# Altium project Bike_Light_PCB_2017.PrjPcb
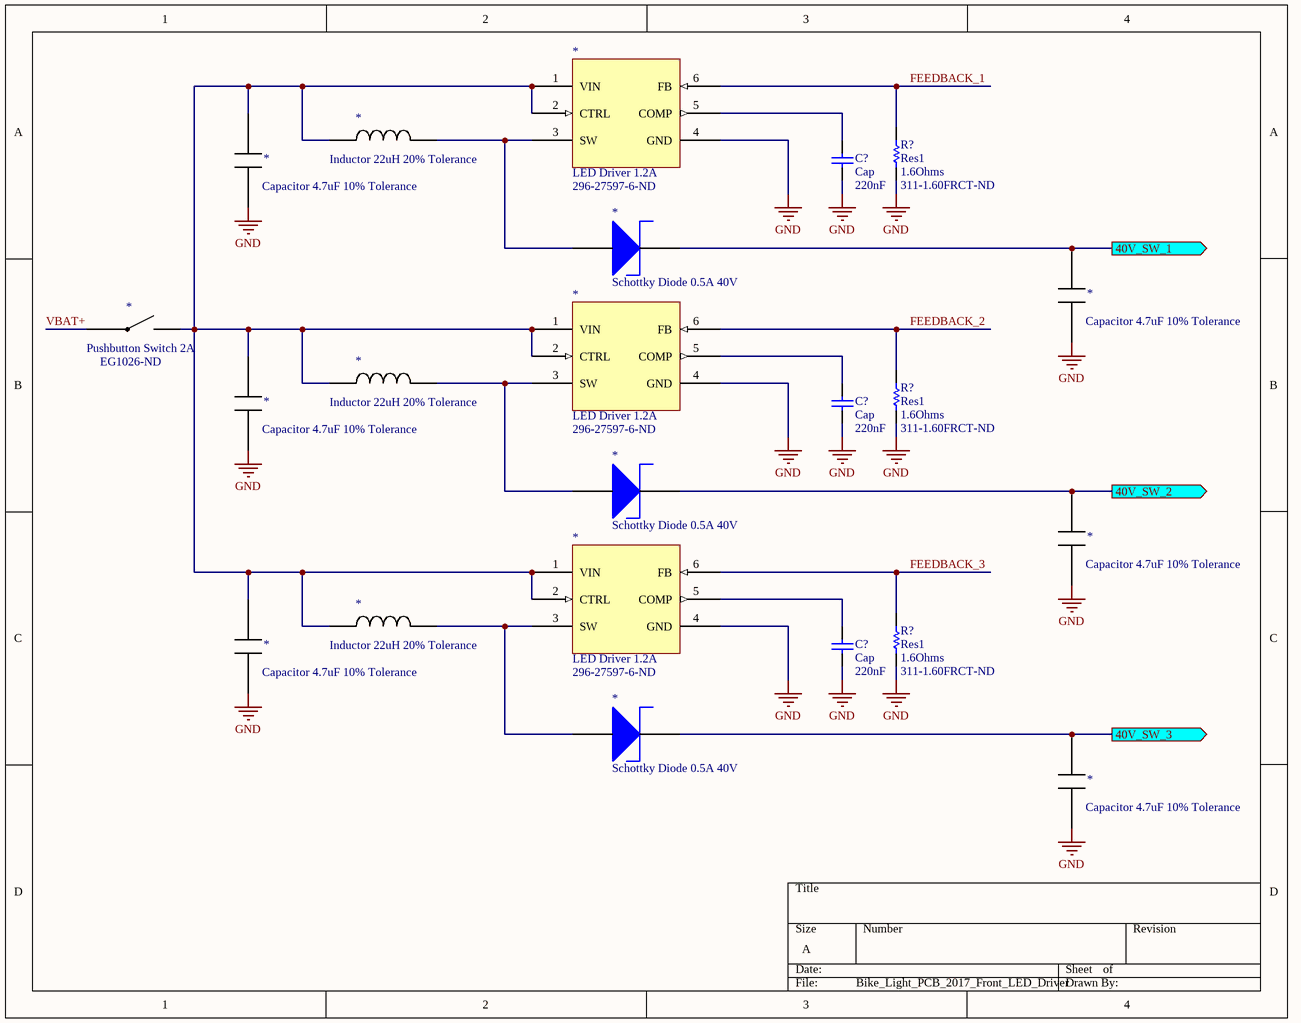
[diagram p0: Bike_Light_PCB_2017_Front_LED_Driver.SchDoc]
3 sheets, 46 parts. Net scope: flat (ports and power ports of the same name join across sheets).
Sheets:
  Bike_Light_PCB_2017_Front_LED_Driver.SchDoc
  Bike_Light_PCB_2017_Front_LED.SchDoc
  Bike_Light_PCB_2017_Power.SchDoc

## Sheet Bike_Light_PCB_2017_Front_LED_Driver.SchDoc
size A

### Parts
(Parts that share a designator on the sheet are numbered #1, #2 ... from top to bottom, then left to right.)
*#1  Inductor 22uH 20% Tolerance
*#2  Capacitor 4.7uF 10% Tolerance
*#3  LED Driver 1.2A  Supplier Part Number 1: 296-27597-6-ND
*#4  Schottky Diode 0.5A 40V
*#5  Capacitor 4.7uF 10% Tolerance
*#6  Pushbutton Switch 2A  Supplier Part Number 1: EG1026-ND
*#7  Inductor 22uH 20% Tolerance
*#8  Capacitor 4.7uF 10% Tolerance
*#9  LED Driver 1.2A  Supplier Part Number 1: 296-27597-6-ND
*#10  Schottky Diode 0.5A 40V
*#11  Capacitor 4.7uF 10% Tolerance
*#12  Inductor 22uH 20% Tolerance
*#13  Capacitor 4.7uF 10% Tolerance
*#14  LED Driver 1.2A  Supplier Part Number 1: 296-27597-6-ND
*#15  Schottky Diode 0.5A 40V
*#16  Capacitor 4.7uF 10% Tolerance
C?#1  Cap  value 220nF  [RAD-0.3]
C?#2  Cap  value 220nF  [RAD-0.3]
C?#3  Cap  value 220nF  [RAD-0.3]
R?#1  Res1  value 1.6Ohms  Supplier Part Number 1: 311-1.60FRCT-ND  [AXIAL-0.3]
R?#2  Res1  value 1.6Ohms  Supplier Part Number 1: 311-1.60FRCT-ND  [AXIAL-0.3]
R?#3  Res1  value 1.6Ohms  Supplier Part Number 1: 311-1.60FRCT-ND  [AXIAL-0.3]

### Ports
40V_SW_1 (out), 40V_SW_2 (out), 40V_SW_3 (out)

### Nets
GND: *#2.0 *#3.4(GND) *#5.0 *#8.0 *#9.4(GND) *#11.0 *#13.0 *#14.4(GND) *#16.0 C?#1.1 C?#2.1 C?#3.1 R?#1.1 R?#2.1 R?#3.1  [project net ENABLE]
FEEDBACK_1: *#3.6(FB) R?#1.2
FEEDBACK_2: *#9.6(FB) R?#2.2
FEEDBACK_3: *#14.6(FB) R?#3.2
VBAT+: *#6.10
Net*#1_28: *#1.28 *#2.1 *#3.1(VIN) *#3.2(CTRL) *#6.11 *#7.28 *#8.1 *#9.1(VIN) *#9.2(CTRL) *#12.28 *#13.1 *#14.1(VIN) *#14.2(CTRL)
Net*#1_29: *#1.29 *#3.3(SW) *#4.2
Net*#3_5: *#3.5(COMP) C?#1.2
Net*#4_3: *#4.3 *#5.1 ; port 40V_SW_1
Net*#7_29: *#7.29 *#9.3(SW) *#10.2
Net*#9_5: *#9.5(COMP) C?#2.2
Net*#10_3: *#10.3 *#11.1 ; port 40V_SW_2
Net*#12_29: *#12.29 *#14.3(SW) *#15.2
Net*#14_5: *#14.5(COMP) C?#3.2
Net*#15_3: *#15.3 *#16.1 ; port 40V_SW_3

### Library data of the parts
C?#1-C?#3 = Cap: Capacitor; Published: 8-Jun-2000; LatestRevisionDate: 17-Jul-2002; LatestRevisionNote: Re-released for DXP Platform.; PackageReference: RAD-0.3; Publisher: Altium Limited; PackageDescription: Radial Cap, Thru-Hole; 2 Leads; 0.3 in Pin Spacing; Supplier 1: Digi-Key; Supplier Part Number 1: 399-14760-1-ND
R?#1-R?#3 = Res1: Resistor; Published: 8-Jun-2000; LatestRevisionDate: 17-Jul-2002; LatestRevisionNote: Re-released for DXP Platform.; PackageReference: AXIAL-0.3; Publisher: Altium Limited; PackageDescription: Axial Device, Thru-Hole; 2 Leads; 0.3 in Pin Spacing; Supplier 1: Digi-Key
*#1 *#7 *#12 = Inductor 22uH 20% Tolerance: Supplier 1: Digi-Key; Supplier Part Number 1: 445-174218-1-ND
*#2 *#5 *#8 *#11 *#13 *#16 = Capacitor 4.7uF 10% Tolerance: Supplier 1: Digi-Key; Supplier Part Number 1: 587-5034-2-ND
*#3 *#9 *#14 = LED Driver 1.2A: Supplier 1: Digi-Key
*#4 *#10 *#15 = Schottky Diode 0.5A 40V: Supplier 1: Digi-Key; Supplier Part Number 1: MBR0540CT-ND
*#6 = Pushbutton Switch 2A: Supplier 1: Digi-Key

## Sheet Bike_Light_PCB_2017_Front_LED.SchDoc
size A
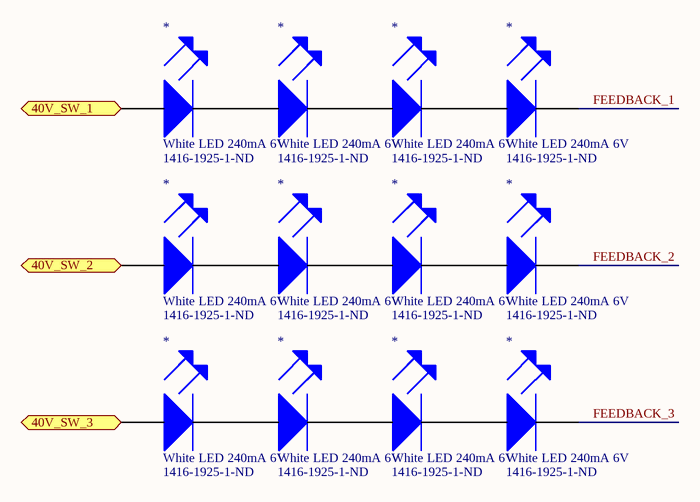
[diagram p1: Bike_Light_PCB_2017_Front_LED.SchDoc]

### Parts
(Parts that share a designator on the sheet are numbered #1, #2 ... from top to bottom, then left to right.)
*#17  White LED 240mA 6V  Supplier Part Number 1: 1416-1925-1-ND
*#18  White LED 240mA 6V  Supplier Part Number 1: 1416-1925-1-ND
*#19  White LED 240mA 6V  Supplier Part Number 1: 1416-1925-1-ND
*#20  White LED 240mA 6V  Supplier Part Number 1: 1416-1925-1-ND
*#21  White LED 240mA 6V  Supplier Part Number 1: 1416-1925-1-ND
*#22  White LED 240mA 6V  Supplier Part Number 1: 1416-1925-1-ND
*#23  White LED 240mA 6V  Supplier Part Number 1: 1416-1925-1-ND
*#24  White LED 240mA 6V  Supplier Part Number 1: 1416-1925-1-ND
*#25  White LED 240mA 6V  Supplier Part Number 1: 1416-1925-1-ND
*#26  White LED 240mA 6V  Supplier Part Number 1: 1416-1925-1-ND
*#27  White LED 240mA 6V  Supplier Part Number 1: 1416-1925-1-ND
*#28  White LED 240mA 6V  Supplier Part Number 1: 1416-1925-1-ND

### Ports
40V_SW_1 (in), 40V_SW_2 (in), 40V_SW_3 (in)

### Nets
FEEDBACK_1: *#20.3
FEEDBACK_2: *#24.3
FEEDBACK_3: *#28.3
Net*#4_3: *#17.2 ; port 40V_SW_1
Net*#10_3: *#21.2 ; port 40V_SW_2
Net*#15_3: *#25.2 ; port 40V_SW_3
Net*#17_3: *#17.3 *#18.2
Net*#18_3: *#18.3 *#19.2
Net*#19_3: *#19.3 *#20.2
Net*#21_3: *#21.3 *#22.2
Net*#22_3: *#22.3 *#23.2
Net*#23_3: *#23.3 *#24.2
Net*#25_3: *#25.3 *#26.2
Net*#26_3: *#26.3 *#27.2
Net*#27_3: *#27.3 *#28.2

### Library data of the parts
*#17-*#28 = White LED 240mA 6V: Supplier 1: Digi-Key

## Sheet Bike_Light_PCB_2017_Power.SchDoc
size A4
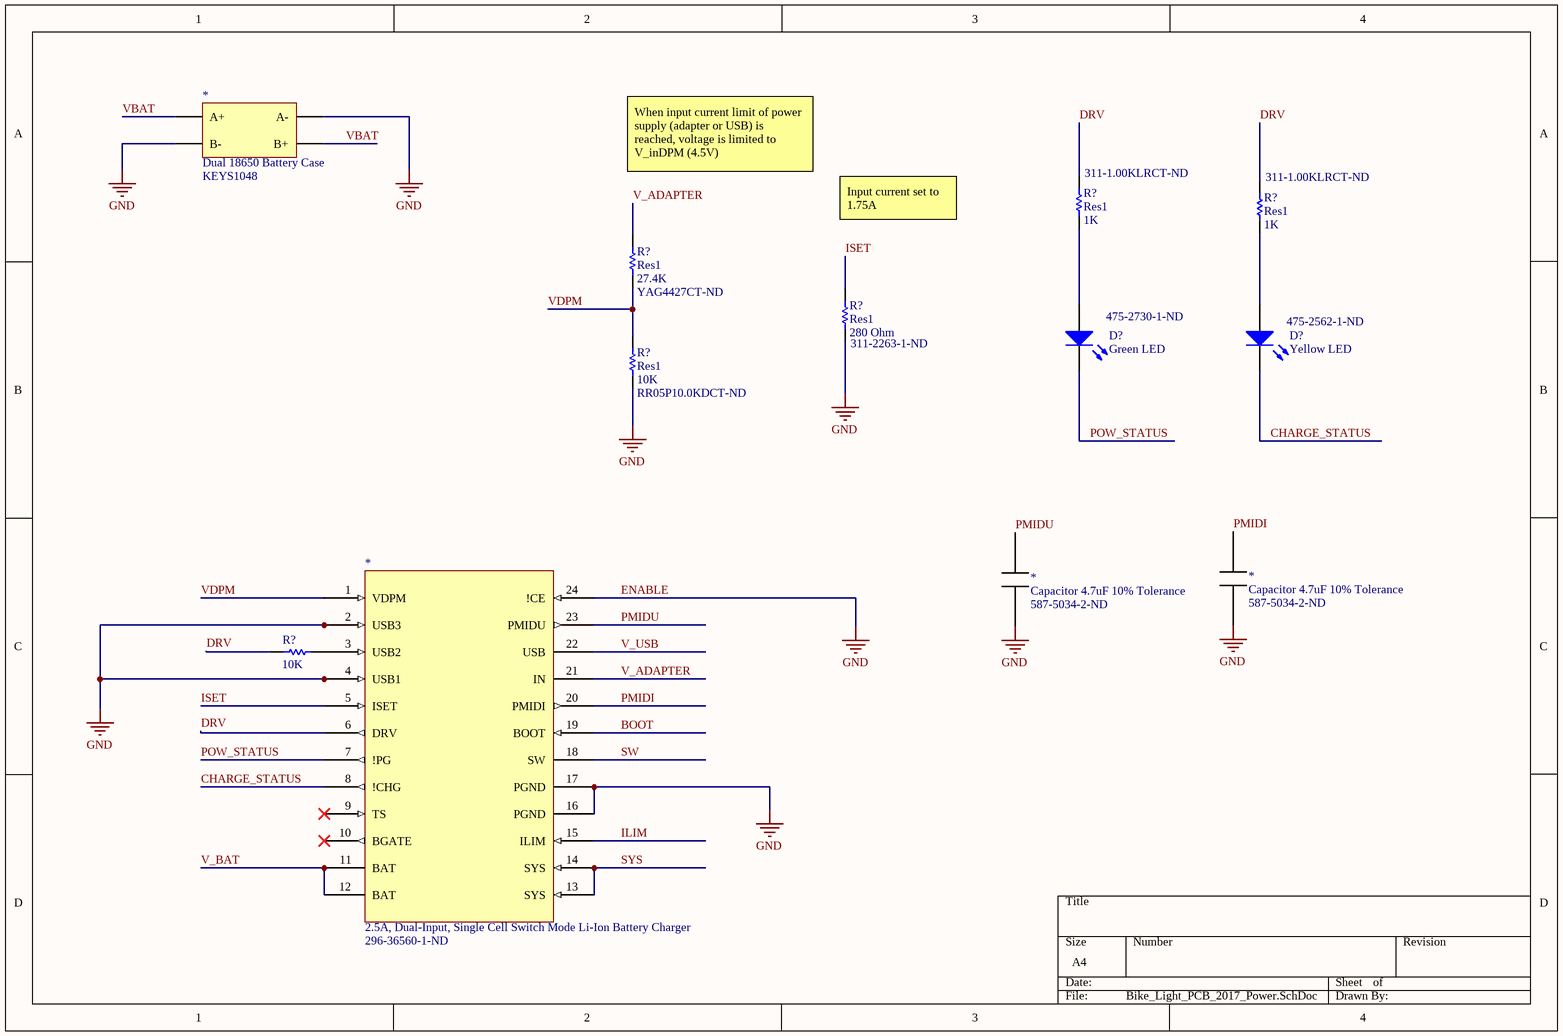
[diagram p2: Bike_Light_PCB_2017_Power.SchDoc]

### Parts
(Parts that share a designator on the sheet are numbered #1, #2 ... from top to bottom, then left to right.)
*#29  Dual 18650 Battery Case  Supplier Part Number 1: KEYS1048
*#30  Capacitor 4.7uF 10% Tolerance  Supplier Part Number 1: 587-5034-2-ND
*#31  Capacitor 4.7uF 10% Tolerance  Supplier Part Number 1: 587-5034-2-ND
*#32  2.5A, Dual-Input, Single Cell Switch Mode Li-Ion Battery Charger  Supplier Part Number 1: 296-36560-1-ND
D?#1  Green LED  Supplier Part Number 1: 475-2730-1-ND  [LED-0]
D?#2  Yellow LED  Supplier Part Number 1: 475-2562-1-ND  [LED-0]
R?#4  Res1  value 1K  Supplier Part Number 1: 311-1.00KLRCT-ND  [AXIAL-0.3]
R?#5  Res1  value 1K  Supplier Part Number 1: 311-1.00KLRCT-ND  [AXIAL-0.3]
R?#6  Res1  value 27.4K  Supplier Part Number 1: YAG4427CT-ND  [AXIAL-0.3]
R?#7  Res1  value 280 Ohm  Supplier Part Number 1: 311-2263-1-ND  [AXIAL-0.3]
R?#8  Res1  value 10K  Supplier Part Number 1: RR05P10.0KDCT-ND  [AXIAL-0.3]
R?#9  value 10K  [AXIAL-0.3]  (hidden comment: Res1)

### Nets
ENABLE: *#29.?1(A-) *#29.?4(B-) *#30.0 *#31.0 *#32.2(USB3) *#32.4(USB1) *#32.16(PGND) *#32.17(PGND) *#32.24(!CE) R?#7.1 R?#8.1  [also labelled GND]
BOOT: *#32.19(BOOT)
CHARGE_STATUS: *#32.8(!CHG) D?#2.2(K)
DRV: *#32.6(DRV) R?#4.2 R?#5.2 R?#9.2
ILIM: *#32.15(ILIM)
ISET: *#32.5(ISET) R?#7.2
PMIDI: *#31.1 *#32.20(PMIDI)
PMIDU: *#30.1 *#32.23(PMIDU)
POW_STATUS: *#32.7(!PG) D?#1.2(K)
SW: *#32.18(SW)
SYS: *#32.13(SYS) *#32.14(SYS)
V_ADAPTER: *#32.21(IN) R?#6.2
V_BAT: *#32.11(BAT) *#32.12(BAT)
V_USB: *#32.22(USB)
VBAT: *#29.?2(B+) *#29.?3(A+)
VDPM: *#32.1(VDPM) R?#6.1 R?#8.2
Net*#32_3: *#32.3(USB2) R?#9.1
NetD?#1_1: D?#1.1(A) R?#4.1
NetD?#2_1: D?#2.1(A) R?#5.1

Not connected (* = marked no-connect by the designer): *#32 9(TS)* 10(BGATE)*

### Notes on the sheet
- When input current limit of power supply (adapter or USB) is reached, voltage is limited to V_inDPM (4.5V)
- Input current set to 1.75A

### Library data of the parts
D?#1 D?#2 = LED0: Typical INFRARED GaAs LED; Published: 8-Jun-2000; LatestRevisionDate: 08-Jul-2005; LatestRevisionNote: Mech Layer 1 removed.; PackageReference: LED-0; Publisher: Altium Limited; PackageDescription: LED; 2 Leads; Supplier 1: Digi-Key
R?#4-R?#9 = Res1: Resistor; Published: 8-Jun-2000; LatestRevisionDate: 17-Jul-2002; LatestRevisionNote: Re-released for DXP Platform.; PackageReference: AXIAL-0.3; Publisher: Altium Limited; PackageDescription: Axial Device, Thru-Hole; 2 Leads; 0.3 in Pin Spacing; Supplier 1: Digi-Key
  R?#9: Supplier Part Number 1: RR05P10.0KDCT-ND
*#29 = Dual 18650 Battery Case: Supplier 1: TME
*#30 *#31 = Capacitor 4.7uF 10% Tolerance: Supplier 1: Digi-Key
*#32 = 2.5A, Dual-Input, Single Cell Switch Mode Li-Ion Battery Charger: Supplier 1: Digi-Key

## Nets that join several sheets
ENABLE: Bike_Light_PCB_2017_Front_LED_Driver (15 pins), Bike_Light_PCB_2017_Power (11 pins)
Net*#4_3: Bike_Light_PCB_2017_Front_LED_Driver (*#4.3 *#5.1), Bike_Light_PCB_2017_Front_LED (*#17.2)
Net*#10_3: Bike_Light_PCB_2017_Front_LED_Driver (*#10.3 *#11.1), Bike_Light_PCB_2017_Front_LED (*#21.2)
Net*#15_3: Bike_Light_PCB_2017_Front_LED_Driver (*#15.3 *#16.1), Bike_Light_PCB_2017_Front_LED (*#25.2)